# Altium schematic sheet AdamCapteurs-2.SchDoc: Adam Capteurs
size Letter; Author: Camille Fortin; Organization: Cégep Limoilou; Address1: 1300 8e Ave; Address2: Québec City, QC; Address3: G1J 5L5; Revision: A; SheetNumber: 2; SheetTotal: 2; Titre: Adam Capteurs; Modification: 2023-05-02; Conception: Camille Fortin
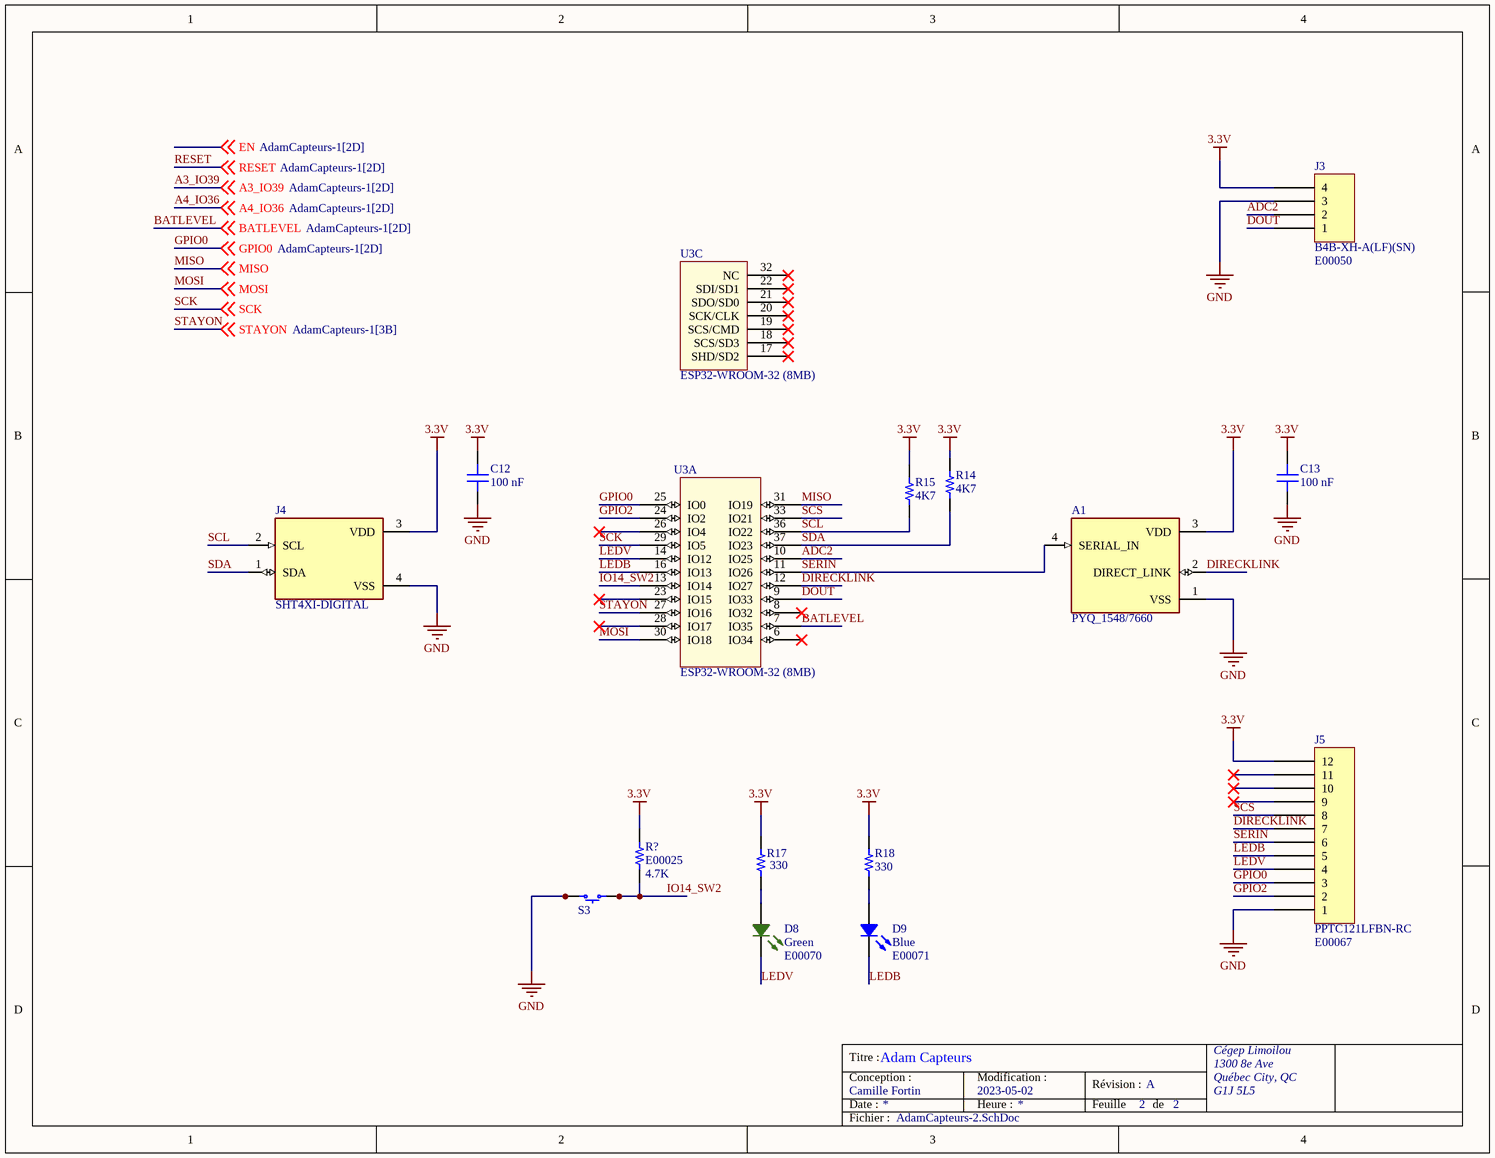
[diagram p0: AdamCapteurs-2.SchDoc]

## Parts
A1  PYQ_1548/7660  [TO254P940H440-4]
C12  100 nF  [CAP 0603]
C13  100 nF  [CAP 0603]
D8  Green  ADAM Inventory Number 1: E00070  [Green LED 0603]
D9  Blue  ADAM Inventory Number 1: E00071  [Blue LED 0603]
J3  B4B-XH-A(LF)(SN)  ADAM Inventory Number 1: E00050  [CONN JST 4PIN]
J4  SHT4XI-DIGITAL  [SHT4XI-DIGITAL]
J5  PPTC121LFBN-RC  ADAM Inventory Number 1: E00067  [CONN 12PIN FEMALE]
R14  4K7  [RES 0603]
R15  4K7  [RES 0603]
R17  330  [RES 0603]
R18  330  [RES 0603]
R?  ADAM Inventory Number 1: E00025  [RES 0603]  (hidden comment: 4.7K)
S3  KMR741NG ULC LFS  [Switch Lin SMD]  (value not drawn)
U3  ESP32-WROOM-32 (8MB)  [ESP32-WROOM-32D]  (parts A,C of 3)

## Nets
3.3V: A1.3(VDD) C12.2 C13.2 J3.4 J4.3(VDD) J5.12 R14.2 R15.2 R17.2 R18.2 R?.2
GND: A1.1(VSS) C12.1 C13.1 J3.3 J4.4(VSS) J5.1 S3.3 S3.4
ADC2: J3.2 U3.10(IO25)
BATLEVEL: U3.7(IO35) ; off-sheet BATLEVEL
DIRECKLINK: A1.2(DIRECT_LINK) J5.7 U3.12(IO27)
DOUT: J3.1 U3.9(IO33)
GPIO0: J5.3 U3.25(IO0) ; off-sheet GPIO0
GPIO2: J5.2 U3.24(IO2)
IO14_SW2: R?.1 S3.1 S3.2 U3.13(IO14)
LEDB: D9.2 J5.5 U3.16(IO13)
LEDV: D8.2 J5.4 U3.14(IO12)
MISO: U3.31(IO19) ; off-sheet MISO
MOSI: U3.30(IO18) ; off-sheet MOSI
SCK: U3.29(IO5) ; off-sheet SCK
SCL: J4.2(SCL) R15.1 U3.36(IO22)
SCS: J5.8 U3.33(IO21)
SDA: J4.1(SDA) R14.1 U3.37(IO23)
SERIN: A1.4(SERIAL_IN) J5.6 U3.11(IO26)
STAYON: U3.27(IO16) ; off-sheet STAYON
NetD8_1: D8.1 R17.1
NetD9_1: D9.1 R18.1

Not connected (* = marked no-connect by the designer): J5 9* 10* 11*; U3 6(IO34)* 8(IO32)* 17(SHD/SD2)* 18(SCS/SD3)* 19(SCS/CMD)* 20(SCK/CLK)* 21(SDO/SD0)* 22(SDI/SD1)* 23(IO15)* 26(IO4)* 28(IO17)* 32(NC)*

## Notes on the sheet
- Titre :
- Conception :
- Date :
- Modification :
- Heure :
- Révision :
- Feuille
- de
- Fichier :

## Library data of the parts
A1 = PYQ_1548/7660: Sensor PIR _Passive Infrared_ Low Power TO-5 Variant, 4 Leads, Lens Top Metal Can; MF: Excelitas Technologies; MP: PYQ 1548/7660; Package: TO-5 Excelitas Technologies; Price: None; Availability: Unavailable; SnapEDA_Link: https://www.snapeda.com/parts/PYQ%201548/7660/Excelitas%20Technologies/view-part/4328334/?ref=snap; Value: *
C12 C13 = Capacitor: CAP CER 10UF 10V X6S 0603; Part Number: GRM188C81A106MA73D; manufacturer: Murata Electronics; Capacitance: 10 µF; Tolerance: ±20%; Value: 100 nF; Applications: General Purpose; componentlink1description: Datasheet; componentlink1url: https://www.murata.com/~/media/webrenewal/support/library/catalog/products/capacitor/mlcc/c02e.ashx?la=en-us; componentlink2description: DigiKey Link; componentlink2url: https://www.digikey.com/en/products/detail/murata-electronics/GRM188C81A106MA73D/3900461; Device Package: 0603 (1608 Metric); lastupdated: 2023-03-27 19:07:26; Lifecycle Status: Active; Minimum Order: 1; Mounting Type: Surface Mount, MLCC; Operating Temperature: -55°C ~ 105°C; Package / Case: 0603 (1608 Metric); packaging: TapeAndReel; partid: 2456; Part Status: Active; price: 0.04; series: GRM; Size / Dimension: 0.063" L x 0.031" W (1.60mm x 0.80mm); Supplier 1: DigiKey; Supplier Part Number 1: 490-7197-1-ND; Temperature Coefficient: X6S; Thickness (Max): 0.039" (1.00mm); Voltage - Rated: 10V; Manufacturer Part Number 1: GRM188C81A106MA73D
D8 = 0603 GREEN LED: LED GREEN 0603 SMD; Manufacturer Part Number 1: 5973316507F; Manufacturer: Dialight; Configuration: Standard; Current - Test: 20mA; Lens Color: 1.24mm; Lens Style: Round with Domed Top; Millicandela Rating: 34mcd; Voltage - Forward (Vf) (Typ): 2V; Wavelength - Dominant: 560nm; Color: Green; ComponentLink1Description: Datasheet; ComponentLink1URL: http://www.dialightsignalsandcomponents.com/Assets/Drawings/2D_Drawings_DrawingDetailedSpec/NewDrawings/C18371C.pdf; ComponentLink2Description: DigiKey Link; ComponentLink2URL: https://www.digikey.com/en/products/detail/dialight/5973316507F/9385428; Device Package: 0603 (1608 Metric); Height (Max): 1.24mm; LastUpdated: 2023-03-27 19:52:49; Lifecycle Status: Active; Minimum Order: 1; Mounting Type: Surface Mount; Package / Case: 0603 (1608 Metric); Packaging: TapeAndReel; PartId: 587; Part Status: Active; Price: 0.13; Series: 597; Size / Dimension: 1.60mm L x 0.80mm W; Supplier 1: DigiKey; Supplier Part Number 1: 350-4373-1-ND; Supplier Device Package: 0603; Value: Green
D9 = 0603 BLUE LED: Blue 470nm LED Indication - Discrete 3.3V 0603 (1608 Metric); Manufacturer Part Number 1: APT1608LVBC/D; Supplier 1: Digi-Key; Supplier Part Number 1: 754-1933-1-ND
J3 = CONN JST 4POS TH: CONN HEADER VERT 4POS 2.5MM; Manufacturer: JST Sales America Inc.; Contact Length - Post: 0.134" (3.40mm); Current Rating (Amps): 3A; Material Flammability Rating: UL94 V-0; Number of Positions: 4; Number of Positions Loaded: All; Pitch - Mating: 0.098" (2.50mm); Shrouding: Shrouded - 4 Wall; Style: Board to Cable/Wire; Voltage Rating: 250V; Manufacturer Part Number 1: B4B-XH-A(LF)(SN); ComponentLink1Description: Datasheet; ComponentLink1URL: http://www.jst-mfg.com/product/pdf/eng/eXH.pdf; ComponentLink2Description: DigiKey Link; ComponentLink2URL: http://digikey.com/product-detail/en/jst-sales-america-inc/B4B-XH-A-LF-SN/455-2249-ND/1651047; Connector Type: Header; Contact Finish - Mating: Tin; Contact Finish - Post: Tin; Contact Material: Brass; Contact Shape: Square; Contact Type: Male Pin; Fastening Type: Detent Lock; Insulation Color: Natural; Insulation Height: 0.276" (7.00mm); Insulation Material: Polyamide (PA66), Nylon 6/6; LastUpdated: 2020-01-12 23:46:34; Lifecycle Status: Active; Minimum Order: 1; Mounting Type: Through Hole; Number of Rows: 1; Operating Temperature: -25°C ~ 85°C; Packaging: Bulk; PartId: 69; Part Status: Active; Price: 0.21; Series: XH; Supplier 1: DigiKey; Supplier Part Number 1: 455-2249-ND; Termination: Press-Fit, Solder
J4 = SHT4XI-DIGITAL: Industrial Grade Digital Relative Humidity Temperature Sensor, Â±2% / max 4% RH, Â±0.2 Â°C; MP: SHT40I-AD1B-R3; MF: Sensirion; Value: *; Package: DFN-4 Sensirion; Check_prices: https://www.snapeda.com/parts/SHT40I-AD1B-R3/Sensirion/view-part/?ref=eda; Price: None; SnapEDA_Link: https://www.snapeda.com/parts/SHT40I-AD1B-R3/Sensirion/view-part/?ref=snap; Purchase-URL: https://pricing.snapeda.com/search/part/SHT40I-AD1B-R3/?ref=eda; Availability: In Stock
J5 = 12PO FEM HEADER: CONN RCPT 12POS 0.1 GOLD PCB; Manufacturer: Harwin Inc.; Connector Type: Receptacle; Current Rating (Amps): 3A; Mated Stacking Heights: 11.04mm, 12.63mm; Material Flammability Rating: UL94 V-0; Number of Positions: 12; Number of Positions Loaded: All; Style: Board to Board or Cable; ComponentLink1Description: Datasheet; ComponentLink1URL: https://cdn.harwin.com/pdfs/C001XX_M20_Series_Connectors.pdf; ComponentLink2Description: DigiKey Link; ComponentLink2URL: http://digikey.com/product-detail/en/harwin-inc/M20-7821242/952-1852-ND/3727819; Contact Finish - Mating: Gold; Contact Finish - Post: Tin; Contact Finish Thickness - Mating: Flash; Contact Type: Female Socket; Fastening Type: Push-Pull; Insulation Color: Black; LastUpdated: 2022-09-21 18:59:31; Lifecycle Status: Active; Minimum Order: 5004; Mounting Type: Through Hole; Number of Rows: 1; Operating Temperature: -40°C ~ 105°C; Packaging: Tube; Part Status: Active; Price: 0.74; Series: M20; Termination: Solder; Supplier 1: Digi-Key; Supplier Part Number 1: S6100-ND; Manufacturer Part Number 1: PPTC121LFBN-RC
R14 R15 = Resistor: RES SMD 4.7K OHM 1% 1/10W 0603; Part Number: RT0603FRE074K7L; Manufacturer: Yageo; Power (Watts): 0.1W, 1/10W; Resistance: 4.7 kOhms; Temperature Coefficient: ±50ppm/°C; Value: 4K7; ComponentLink1Description: Datasheet; ComponentLink1URL: https://www.yageo.com/upload/media/product/productsearch/datasheet/rchip/PYu-RT_1-to-0.01_RoHS_L_11.pdf; ComponentLink2Description: DigiKey Link; ComponentLink2URL: https://www.digikey.com/en/products/detail/yageo/RT0603FRE074K7L/1075404; Composition: Thin Film; Device Package: 0603 (1608 Metric); Height - Seated (Max): 0.022" (0.55mm); LastUpdated: 2023-03-28 19:30:03; Lifecycle Status: Active; Minimum Order: 1; Number of Terminations: 2; Operating Temperature: -55°C ~ 155°C; Package / Case: 0603 (1608 Metric); Packaging: TapeAndReel; PartId: 5678; Part Status: Active; Price: 0.01; Series: RT; Size / Dimension: 0.063" L x 0.031" W (1.60mm x 0.80mm); Supplier 1: DigiKey; Supplier Part Number 1: YAG1238CT-ND; Supplier Device Package: 0603; Tolerance: ±1%; Manufacturer Part Number 1: RT0603FRE074K7L
R17 R18 = Resistor: RES SMD 1K OHM 0.1% 1/16W 0603; Part Number: CPF0603B1K0E; Manufacturer: TE Connectivity Passive Product; Power (Watts): 0.063W, 1/16W; Resistance: 1 kOhms; Temperature Coefficient: ±25ppm/°C; Value: 330; ComponentLink1Description: Datasheet; ComponentLink1URL: https://www.te.com/commerce/DocumentDelivery/DDEController?Action=srchrtrv&DocNm=1773200&DocType=DS&DocLang=English; ComponentLink2Description: DigiKey Link; ComponentLink2URL: https://www.digikey.com/en/products/detail/te-connectivity-passive-product/CPF0603B1K0E/2390473; Composition: Thin Film; Device Package: 0603 (1608 Metric); Height - Seated (Max): 0.022" (0.55mm); LastUpdated: 2023-03-28 19:30:06; Lifecycle Status: Active; Minimum Order: 1; Number of Terminations: 2; Operating Temperature: -55°C ~ 155°C; Package / Case: 0603 (1608 Metric); Packaging: TapeAndReel; PartId: 4877; Part Status: Active; Price: 0.09; Series: CPF, Neohm; Size / Dimension: 0.061" L x 0.031" W (1.55mm x 0.80mm); Supplier 1: DigiKey; Supplier Part Number 1: A119887CT-ND; Supplier Device Package: 0603; Tolerance: ±0.1%; Manufacturer Part Number 1: CPF0603B1K0E
R? = RES SMD 4.7K OHM: RES 4.7K OHM 1% 1/10W 0603; Manufacturer Part Number 1: RC0603FR-074K7L; Manufacturer: Stackpole Electronics Inc; Power (Watts): 0.1W, 1/10W; Temperature Coefficient: ±100ppm/°C; ComponentLink1Description: Datasheet; ComponentLink1URL: https://www.seielect.com/catalog/sei-rmcf_rmcp.pdf; ComponentLink2Description: DigiKey Link; ComponentLink2URL: https://www.digikey.com/en/products/detail/stackpole-electronics-inc/RMCF0603FT4K70/1760998; Composition: Thick Film; Device Package: 0603 (1608 Metric); Features: Automotive AEC-Q200; Height - Seated (Max): 0.022" (0.55mm); LastUpdated: 2023-04-04 19:29:43; Lifecycle Status: Active; Minimum Order: 1; Number of Terminations: 2; Operating Temperature: -55°C ~ 155°C; Package / Case: 0603 (1608 Metric); Packaging: CutTape; PartId: 6078; Part Status: Active; Price: 0.01; Ratings: AEC-Q200; Resistance: 4.7K; Series: RMCF; Size / Dimension: 0.061" L x 0.031" W (1.55mm x 0.80mm); Supplier Device Package: 0603; Tolerance: ±1%; Supplier 1: Digi-Key; Supplier Part Number 1: 311-4.70KHRCT-ND; Value: 4.7K
S3 = SPST-NO 4 PIN: SWITCH TACTILE SPST-NO 50MA 32V; Manufacturer: C&K; Actuator Height off PCB, Vertical: 2.50mm; Actuator Orientation: Top Actuated; Actuator Type: Standard; Contact Rating @ Voltage: 0.05A @ 32VDC; Illumination: Non-Illuminated; Ingress Protection: IP67 - Dust Tight, Waterproof; Operating Force: 400gf; Outline: 4.20mm x 2.80mm; Switch Function: Off-Mom; Part Number: KMR741NG ULC LFS; Circuit: SPST-NO; ComponentLink1Description: Datasheet; ComponentLink1URL: https://dznh3ojzb2azq.cloudfront.net/products/Tactile/KMR7/documents/datasheet.pdf; ComponentLink2Description: DigiKey Link; ComponentLink2URL: http://digikey.com/product-detail/en/c-k/KMR741NG-ULC-LFS/CKN10688CT-ND/6035360; LastUpdated: 2020-04-09 10:01:05; Lifecycle Status: Active; Minimum Order: 1; Mounting Type: Surface Mount; Operating Temperature: -40°C ~ 85°C; Packaging: TapeAndReel; Part Status: Active; Price: 0.16; Series: KMR7; Supplier 1: DigiKey; Supplier Part Number 1: CKN10688CT-ND; Termination Style: Gull Wing; Manufacturer Part Number 1: KMR741NG ULC LFS
U3 = ESP32-WROOM-32 (8MB): No Description Available; Mfr_Name: Espressif Systems; Copyright: Copyright (C) 2023 Ultra Librarian. All rights reserved.; RefDes: RefDes; Type: DEV; Manufacturer Part Number 1: ESP32-WROOM-32 (8MB)